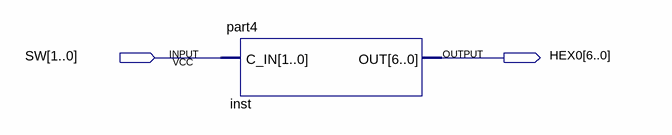
[diagram p0: schematic sheet]
// Quartus schematic part4_sch.bdf as structural Verilog: 1 symbols, 2 pins
module part4_sch (
  input  [1:0] SW,
  output [6:0] HEX0
);

  part4 inst (.C_IN(SW), .OUT(HEX0));
endmodule
